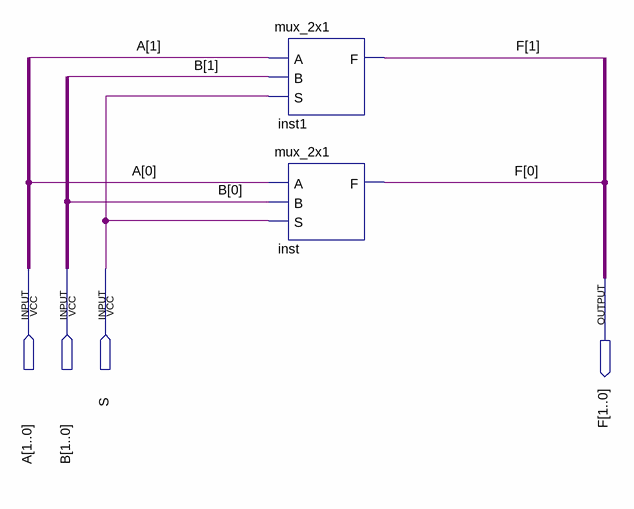
[diagram p0: schematic sheet]
// Quartus schematic mux_4x2.bdf as structural Verilog: 2 symbols, 4 pins
module mux_4x2 (
  input  [1:0] A,
  input  [1:0] B,
  input  S,
  output [1:0] F
);

  mux_2x1 inst1 (.A(A[1]), .B(B[1]), .S(S), .F(F[1]));
  mux_2x1 inst (.A(A[0]), .B(B[0]), .S(S), .F(F[0]));
endmodule
